# Altium schematic sheet Dev_BRD_STM32F103C8T6.SchDoc
size A4 portrait
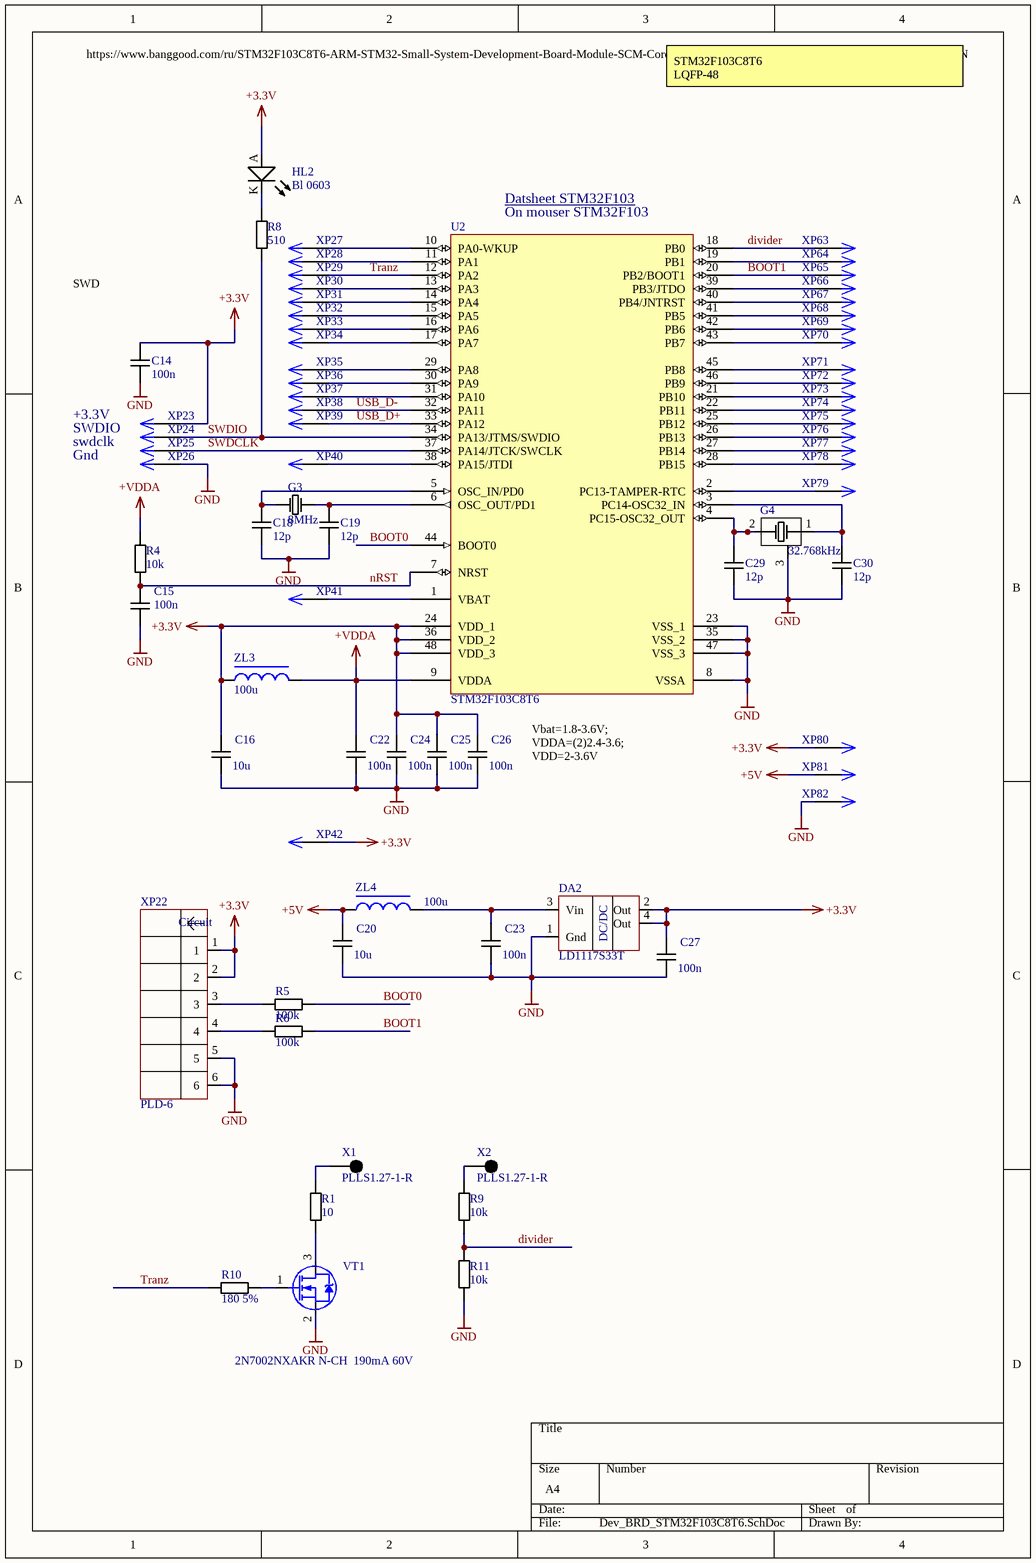
[diagram p0: Dev_BRD_STM32F103C8T6.SchDoc]

## Parts
C14  100n  [CAPC1608(0603)N]
C15  100n  [CAPC1608(0603)N]
C16  10u  [CAPC1608(0603)N]
C18  12p  [CAPC1608(0603)N]
C19  12p  [CAPC1608(0603)N]
C20  10u  [CAPC1608(0603)N]
C22  100n  [CAPC1608(0603)N]
C23  100n  [CAPC1608(0603)N]
C24  100n  [CAPC1608(0603)N]
C25  100n  [CAPC1608(0603)N]
C26  100n  [CAPC1608(0603)N]
C27  100n  [CAPC1608(0603)N]
C29  12p  [CAPC1608(0603)N]
C30  12p  [CAPC1608(0603)N]
DA2  LD1117S33T  [SOT223_M]
G3  8MHz  [HC-49/S]
G4  32.768kHz  [CRYSTAL_CMR309T]
HL2  Bl 0603  [LED-0603-BLUE]
R1  10  [REZKemet 0402]
R4  10k  [RESC1608(0603)N]
R5  100k  [RESC1608(0603)N]
R6  100k  [RESC1608(0603)N]
R8  510  [RESC1608(0603)N]
R9  10k  [RESC1608(0603)N]
R10  180 5%  [REZKemet 0402]
R11  10k  [RESC1608(0603)N]
U2  STM32F103C8T6  [LQFP48_L]
VT1  2N7002NXAKR N-CH  190mА 60V  [SOT23-3N]
X1  PLLS1.27-1-R  [PLLS1.27-1-R]
X2  PLLS1.27-1-R  [PLLS1.27-1-R]
XP22  PLD-6  [PLD-6-3D]
XP23  PLS-1  [PLS-1-3D]  (value not drawn)
XP24  PLS-1  [PLS-1-3D]  (value not drawn)
XP25  PLS-1  [PLS-1-3D]  (value not drawn)
XP26  PLS-1  [PLS-1-3D]  (value not drawn)
XP27  PLS-1  [PLS-1-3D]  (value not drawn)
XP28  PLS-1  [PLS-1-3D]  (value not drawn)
XP29  PLS-1  [PLS-1-3D]  (value not drawn)
XP30  PLS-1  [PLS-1-3D]  (value not drawn)
XP31  PLS-1  [PLS-1-3D]  (value not drawn)
XP32  PLS-1  [PLS-1-3D]  (value not drawn)
XP33  PLS-1  [PLS-1-3D]  (value not drawn)
XP34  PLS-1  [PLS-1-3D]  (value not drawn)
XP35  PLS-1  [PLS-1-3D]  (value not drawn)
XP36  PLS-1  [PLS-1-3D]  (value not drawn)
XP37  PLS-1  [PLS-1-3D]  (value not drawn)
XP38  PLS-1  [PLS-1-3D]  (value not drawn)
XP39  PLS-1  [PLS-1-3D]  (value not drawn)
XP40  PLS-1  [PLS-1-3D]  (value not drawn)
XP41  PLS-1  [PLS-1-3D]  (value not drawn)
XP42  PLS-1  [PLS-1-3D]  (value not drawn)
XP63  PLS-1  [PLS-1-3D]  (value not drawn)
XP64  PLS-1  [PLS-1-3D]  (value not drawn)
XP65  PLS-1  [PLS-1-3D]  (value not drawn)
XP66  PLS-1  [PLS-1-3D]  (value not drawn)
XP67  PLS-1  [PLS-1-3D]  (value not drawn)
XP68  PLS-1  [PLS-1-3D]  (value not drawn)
XP69  PLS-1  [PLS-1-3D]  (value not drawn)
XP70  PLS-1  [PLS-1-3D]  (value not drawn)
XP71  PLS-1  [PLS-1-3D]  (value not drawn)
XP72  PLS-1  [PLS-1-3D]  (value not drawn)
XP73  PLS-1  [PLS-1-3D]  (value not drawn)
XP74  PLS-1  [PLS-1-3D]  (value not drawn)
XP75  PLS-1  [PLS-1-3D]  (value not drawn)
XP76  PLS-1  [PLS-1-3D]  (value not drawn)
XP77  PLS-1  [PLS-1-3D]  (value not drawn)
XP78  PLS-1  [PLS-1-3D]  (value not drawn)
XP79  PLS-1  [PLS-1-3D]  (value not drawn)
XP80  PLS-1  [PLS-1-3D]  (value not drawn)
XP81  PLS-1  [PLS-1-3D]  (value not drawn)
XP82  PLS-1  [PLS-1-3D]  (value not drawn)
ZL3  100u  [INDC1608(0603)N]
ZL4  100u  [INDC1608(0603)N]

## Nets
+3.3V: C14.1 C16.2 C24.2 C25.2 C26.2 C27.2 DA2.2(Out) DA2.4(Out) HL2.A U2.24(VDD_1) U2.36(VDD_2) U2.48(VDD_3) XP22.1 XP22.2 XP23.1 XP42.1 XP80.1 ZL3.1
+5V: C20.2 XP81.1 ZL4.1
+VDDA: C22.2 R4.2 U2.9(VDDA) ZL3.2
GND: C14.2 C15.1 C16.1 C18.1 C19.1 C20.1 C22.1 C23.1 C24.1 C25.1 C26.1 C27.1 C29.1 C30.1 DA2.1(Gnd) G4.3 R11.1 U2.8(VSSA) U2.23(VSS_1) U2.35(VSS_2) U2.47(VSS_3) VT1.2(S) XP22.5 XP22.6 XP26.1 XP82.1
BOOT0: R5.1 U2.44(BOOT0)
BOOT1: R6.1 U2.20(PB2/BOOT1) XP65.1
divider: R9.1 R11.2 U2.18(PB0) XP63.1
nRST: C15.2 R4.1 U2.7(NRST)
SWDCLK: U2.37(PA14/JTCK/SWCLK) XP25.1
SWDIO: R8.2 U2.34(PA13/JTMS/SWDIO) XP24.1
Tranz: R10.1 U2.12(PA2) XP29.1
USB_D+: U2.33(PA12) XP39.1
USB_D-: U2.32(PA11) XP38.1
NetC18_2: C18.2 G3.1 U2.5(OSC_IN/PD0)
NetC19_2: C19.2 G3.2 U2.6(OSC_OUT/PD1)
NetC23_2: C23.2 DA2.3(Vin) ZL4.2
NetC29_2: C29.2 G4.2 U2.4(PC15-OSC32_OUT)
NetC30_2: C30.2 G4.1 U2.3(PC14-OSC32_IN)
NetHL2_K: HL2.K R8.1
NetR1_1: R1.1 VT1.3(D)
NetR1_2: R1.2 X1.1
NetR5_2: R5.2 XP22.3
NetR6_2: R6.2 XP22.4
NetR9_2: R9.2 X2.1
NetR10_2: R10.2 VT1.1(G)
NetU2_1: U2.1(VBAT) XP41.1
NetU2_2: U2.2(PC13-TAMPER-RTC) XP79.1
NetU2_10: U2.10(PA0-WKUP) XP27.1
NetU2_11: U2.11(PA1) XP28.1
NetU2_13: U2.13(PA3) XP30.1
NetU2_14: U2.14(PA4) XP31.1
NetU2_15: U2.15(PA5) XP32.1
NetU2_16: U2.16(PA6) XP33.1
NetU2_17: U2.17(PA7) XP34.1
NetU2_19: U2.19(PB1) XP64.1
NetU2_21: U2.21(PB10) XP73.1
NetU2_22: U2.22(PB11) XP74.1
NetU2_25: U2.25(PB12) XP75.1
NetU2_26: U2.26(PB13) XP76.1
NetU2_27: U2.27(PB14) XP77.1
NetU2_28: U2.28(PB15) XP78.1
NetU2_29: U2.29(PA8) XP35.1
NetU2_30: U2.30(PA9) XP36.1
NetU2_31: U2.31(PA10) XP37.1
NetU2_38: U2.38(PA15/JTDI) XP40.1
NetU2_39: U2.39(PB3/JTDO) XP66.1
NetU2_40: U2.40(PB4/JNTRST) XP67.1
NetU2_41: U2.41(PB5) XP68.1
NetU2_42: U2.42(PB6) XP69.1
NetU2_43: U2.43(PB7) XP70.1
NetU2_45: U2.45(PB8) XP71.1
NetU2_46: U2.46(PB9) XP72.1

## Notes on the sheet
- STM32F103C8T6
  LQFP-48
- https://www.banggood.com/ru/STM32F103C8T6-ARM-STM32-Small-System-Development-Board-Module-SCM-Core-Board-p-1668936.html?rmmds=search&cur_warehouse=CN
- (near U2) On mouser STM32F103
- (near U2) Datsheet STM32F103 <https://eu.mouser.com/datasheet/2/389/cd00161566-1796535.pdf>
- (near C14) SWD
- +3.3V
- SWDIO
- swdclk
- Gnd
- Vbat=1.8-3.6V;
  VDDA=(2)2.4-3.6;
  VDD=2-3.6V
- (in symbol LD1117S33T) DC/DC
- (in symbol PLD-6) Circuit

## Library data of the parts
C14-C16 C18-C20 C22-C27 C29 C30 = CAPC1608(0603): ?; Part Number: CAPC1608(0603); HelpURL: ?; Digi-Key Part Number: ?; Price$: ?; Note: ?; Manufacturer Part Number: ?; Package: ?
DA2 = LD1117S33T: LDO Voltage Regulators 3.3V 0.8A Positive; Part Number: LD1117S33T; HelpURL: http://www.mouser.com/ds/2/389/CD00000544-310772.pdf; Price$: ?; Digi-Key Part Number: ?; Note: ?; Manufacturer Part Number: ?; Package: ?
G3 = Crystal HC-49/S: Part Number: Crystal HC-49/S
G4 = AB26T-32.768KHZ: Crystals 32.768KHz; Part Number: AB26T-32.768KHZ; HelpURL: https://www.mouser.com/ProductDetail/ABRACON/AB26T-32768KHZ?qs=m%252BUhWDcpCfZq%2FBFfwzExYQ%3D%3D; Price$: 0.112; Manufacturer Part Number: AB26T-32.768KHZ; Package: SMD 3pin; Mouser Part Number: 815-AB26T-32.768KHZ
HL2 = 150060BS55040: LED BLUE DIFFUSED 0603 SMD; Part Number: 150060BS55040; HelpURL: https://www.digikey.com/products/en?keywords=732-12013-1-ND; Digi-Key Part Number: 732-12013-1-ND; Manufacturer Part Number: 150060BS55040; Package: 0603
R1 R10 = RMCF0402JT180R: RES SMD 0402 180 5% 100ppm; Part Number: RMCF0402JT180R; HelpURL: https://www.digikey.com/product-detail/en/stackpole-electronics-inc/RMCF0402JT180R/RMCF0402JT180RCT-ND/2417840; Digi-Key Part Number: RMCF0402JT180RCT-ND; Price$: 0.00204; Manufacturer Part Number: RMCF0402JT180R; Package: 0402
R4-R6 R8 R9 R11 = RESC1608(0603): Note: ???; Part Number: RESC1608(0603); HelpURL: ???; Digi-Key Part Number: ???; Price$: ???; Manufacturer Part Number: ???; Package: ???
U2 = STM32F103C8T6: ARM Microcontrollers - MCU 32BIT Cortex M3 64KB 20KB RAM 2X12 ADC; Published: 30-May-2008; DatasheetVersion: rev6, Mar-2008; PackageVersion: Mar-2008; PackageReference: LQFP48; Publisher: Altium Limited; PackageDescription: 48-Pin Low-Profile Quad Flat Pack, 7 x 7 mm Body, 0.5 mm Pitch (LQFP48); ComponentLink1Description: Manufacturer Link; ComponentLink1URL: www.st.com/stm32; ComponentLink2Description: Datasheet; ComponentLink2URL: http://www.st.com/stonline/products/literature/ds/13587.pdf; Part Number: STM32F103C8T6; HelpURL: https://www.mouser.co.uk/ProductDetail/STMicroelectronics/STM32F103C8T6?qs=bhCVus9SdFtq6kqxsU5%2FDA%3D%3D; Price$: 2.60; Manufacturer Part Number: STM32F103C8T6; Package: LQFP-48; Mouser Part Number: 511-STM32F103C8T6
VT1 = 2N7002NXAKR: N-Channel 60V 190mA (Ta), 300mA (Tc) 265mW (Ta), 1.33W (Tc) Surface Mount TO-236AB; Part Number: 2N7002NXAKR; HelpURL: https://www.digikey.com/product-detail/en/nexperia-usa-inc/2N7002NXAKR/1727-8643-1-ND/10416560; Digi-Key Part Number: 1727-8643-1-ND; Price$: 0.01740; Manufacturer Part Number: 2N7002NXAKR; Package: SOT-23-3
XP23-XP42 XP63-XP82 = PLS-1: CONN HEADER VERT 1POS; Manufacturer Part Number: PRPC001SAAN-RC; Note: ???; Part Number: PLS-1; HelpURL: https://www.digikey.com/product-detail/en/sullins-connector-solutions/PRPC001SAAN-RC/S1011EC-01-ND/2775253; Digi-Key Part Number: S1011EC-01-ND; Price$: 0.05
ZL3 ZL4 = Ferite1608(0603): ferite bead; Note: ???; Part Number: Ferite1608(0603); Digi-Key Part Number: ???; Price$: ???; Manufacturer Part Number: ???; Package: ???
X1 X2 = PLLS1.27-1-R: Part Number: PLLS1.27-1-R
XP22 = PLD-6: Part Number: PLD-6